# EAGLE schematic hextokWings03h (EAGLE 9.6.2)
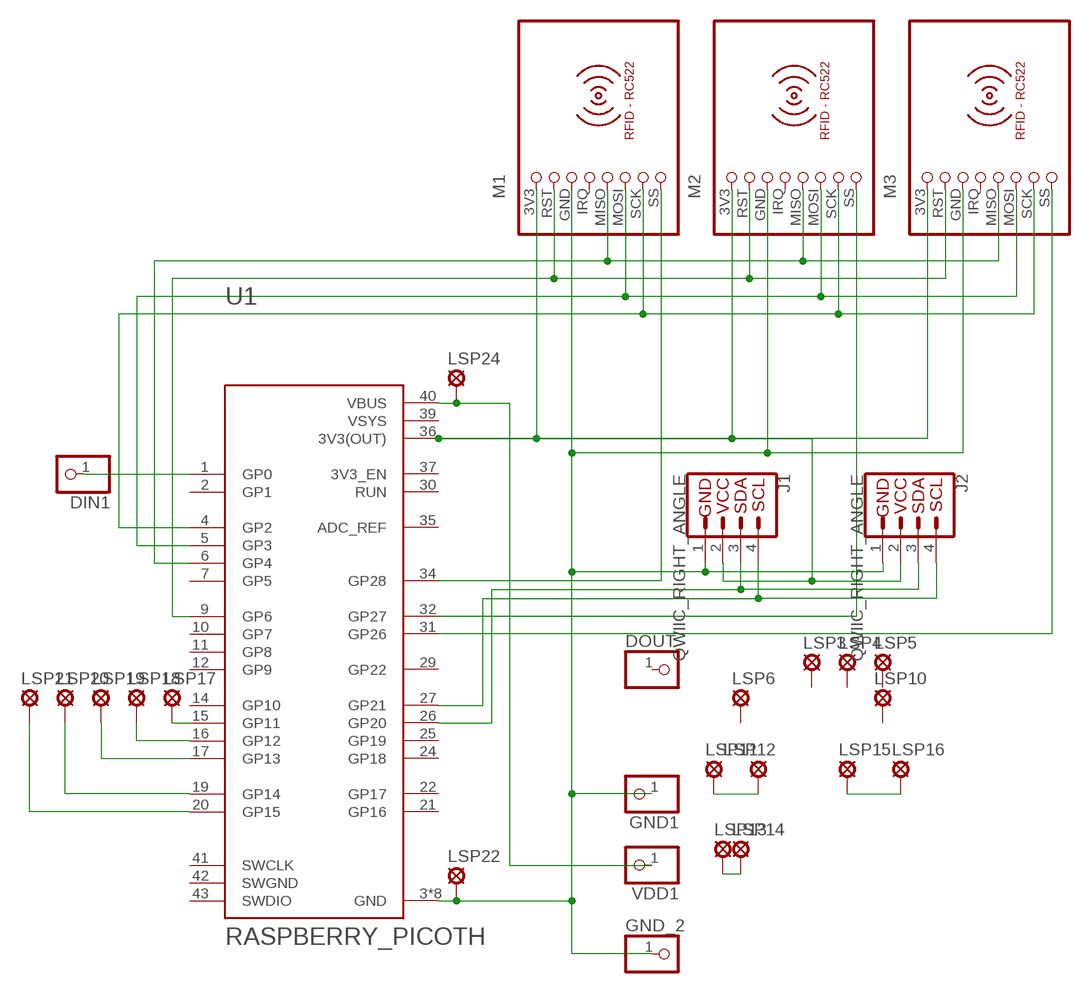
[diagram p0: schematic, sheet 1]

## Parts
DIN1  PINHD-1X1CB  [1X01-CLEANBIG]
DOUT  PINHD-1X1CB  [1X01-CLEANBIG]
GND1  PINHD-1X1CB  [1X01-CLEANBIG]
GND_2  PINHD-1X1CB  [1X01-CLEANBIG]
J1  QWIIC_RIGHT_ANGLE  QWIIC_CONNECTORJS-1MM  [JST04_1MM_RA]
J2  QWIIC_RIGHT_ANGLE  QWIIC_CONNECTORJS-1MM  [JST04_1MM_RA]
LSP3  LSP10  [LSP10]
LSP4  LSP10  [LSP10]
LSP5  LSP10  [LSP10]
LSP6  LSP10  [LSP10]
LSP10  LSP10  [LSP10]
LSP11  LSP10  [LSP10]
LSP12  LSP10  [LSP10]
LSP13  LSP10  [LSP10]
LSP14  LSP10  [LSP10]
LSP15  LSP10  [LSP10]
LSP16  LSP10  [LSP10]
LSP17  LSP10  [LSP10]
LSP18  LSP10  [LSP10]
LSP19  LSP10  [LSP10]
LSP20  LSP10  [LSP10]
LSP21  LSP10  [LSP10]
LSP22  LSP10  [LSP10]
LSP24  LSP10  [LSP10]
M1  RFID-RC522  [RFID-RC522]
M2  RFID-RC522  [RFID-RC522]
M3  RFID-RC522  [RFID-RC522]
U1  RASPBERRY_PICOTH  [PICO-PKG-TH]
VDD1  PINHD-1X1CB  [1X01-CLEANBIG]

## Nets
N$1: J1.2 J2.2 M1.3V3 M2.3V3 M3.3V3 U1.36(3V3(OUT))
N$2: M1.MOSI M2.MOSI M3.MOSI U1.5(GP3)
N$3: M1.SCK M2.SCK M3.SCK U1.4(GP2)
N$4: M1.RST M2.RST M3.RST U1.9(GP6)
N$5: M1.SS U1.34(GP28)
N$7: M2.SS U1.32(GP27)
N$8: M3.SS U1.31(GP26)
N$9: DIN1.1 U1.1(GP0)
N$10: LSP24.MP U1.40(VBUS) VDD1.1
N$11: M1.MISO M2.MISO M3.MISO U1.6(GP4)
N$12: LSP11.MP LSP12.MP
N$13: LSP13.MP LSP14.MP
N$14: LSP15.MP LSP16.MP
N$15: LSP17.MP U1.15(GP11)
N$16: LSP18.MP U1.16(GP12)
N$17: LSP19.MP U1.17(GP13)
N$18: LSP20.MP U1.19(GP14)
N$19: LSP21.MP U1.20(GP15)
N$20: J1.3 J2.3 U1.26(GP20)
N$21: J1.4 J2.4 U1.27(GP21)
N$23: GND1.1 GND_2.1 J1.1 J2.1 LSP22.MP M1.GND M2.GND M3.GND U1.3(GND) U1.8(GND) U1.13(GND) U1.18(GND) U1.23(GND) U1.28(GND) U1.33(GND) U1.38(GND)
Unconnected: DOUT.1 LSP3.MP LSP4.MP LSP5.MP LSP6.MP LSP10.MP M1.IRQ M2.IRQ M3.IRQ U1.2(GP1) U1.7(GP5) U1.10(GP7) U1.11(GP8) U1.12(GP9) U1.14(GP10) U1.21(GP16) U1.22(GP17) U1.24(GP18) U1.25(GP19) U1.29(GP22) U1.30(RUN) U1.35(ADC_REF) U1.37(3V3_EN) U1.41(SWCLK) U1.43(SWDIO)

## Power pins joined to a net without a drawn wire
SWGND: U1.42(SWGND)
VSYS: U1.39(VSYS)

## Library data of the parts
DIN1 DOUT GND1 GND_2 VDD1 = NeoPixelRing:PINHD-1X1: Pin header 1x1 for 0.1" spacing With round pins
J1 J2 = SparkFun-Connectors:QWIIC_CONNECTOR: SparkFun I2C Standard Qwiic Connector An SMD 1mm pitch JST connector makes it easy and quick (get it? Qwiic?) to connect I2C devices to each other. The Qwiic system <http://www.sparkfun.com/qwiic> enables fast and solderless connection between popular platforms and various sensors and actuators. We carry 200mm <https://www.sparkfun.com/products/14204>, 100mm <https://www.sparkfun.com/products/14205>, 50mm <https://www.sparkfun.com/products/14206>, and breadboard friendly <https://www.sparkfun.com/products/14207> Qwiic cables. We also offer 10 pcs strips <https://www.sparkfun.com/products/14323> the SMD connectors.; PROD_ID: CONN-13694
LSP3-LSP6 LSP10-LSP22 LSP24 = solpad:LSP10: SOLDER PAD drill 1.0 mm, distributor Buerklin, 12H555
M1-M3 = mfrc522-module:RFID-RC522: RFID-RC522 MFRC-522 based breakout board
U1 = RpiPico:RASPBERRY_PICO: Raspberry Pi Pico